# Altium project Bao Ve Qua Dong v0.1.PrjPcb
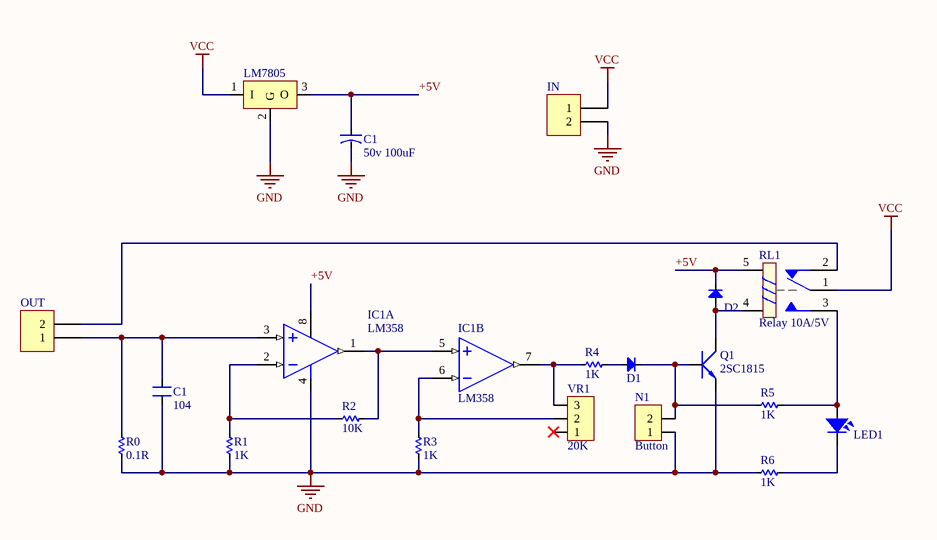
[diagram p0: Nguyen Ly.SchDoc]
1 sheet, 20 parts. Net scope: global (net labels, ports and power ports of the same name join across sheets).
Board file: PCB1.PcbDoc

## Sheet Nguyen Ly.SchDoc
size A

### Parts
(Parts that share a designator on the sheet are numbered #1, #2 ... from top to bottom, then left to right.)
C1#1  50v 100uF  [CA-ALU-5L]
C1#2  104  [CN1.5]
D1  Diode  [DIO-1A]  (value not drawn)
D2  Diode  [DIO-1A]  (value not drawn)
IC1  LM358  [DIP8]  (parts A,B of 2)
IN  (no value)  [KF2-5.08]
LED1  LED  [LED-5-BLUE]  (value not drawn)
LM7805  LM78xx  [TO220-123]  (value not drawn)
N1  Button  [Header2]
OUT  (no value)  [KF2-5.08]
Q1  2SC1815  [TO92-123]
R0  0.1R  [RES-2W]
R1  1K  [RES-1/4W]
R2  10K  [RES-1/4W]
R3  1K  [RES-1/4W]
R4  1K  [RES-1/4W]
R5  1K  [RES-1/4W]
R6  1K  [RES-1/4W]
RL1  Relay 10A/5V  [RELAY 5]
VR1  20K  [Header3]

### Nets
GND: C1#1.2 C1#2.1 IC1.4(-V) IN.2 LM7805.2(G) N1.1 Q1.1(E) R0.2 R1.2 R3.2 R6.2
VCC: IN.1 LM7805.1(I) RL1.1
+5V: C1#1.1 D2.2(K) IC1.8(+V) LM7805.3(O) RL1.5
NetC1#2_2: C1#2.2 IC1.3(IN+) OUT.1 R0.1
NetD1_1: D1.1(A) R4.2
NetD1_2: D1.2(K) N1.2 Q1.3(B) R5.2
NetD2_1: D2.1(A) Q1.2(C) RL1.4
NetIC1_1: IC1.1(OUT) IC1.5(IN+) R2.2
NetIC1_2: IC1.2(IN-) R1.1 R2.1
NetIC1_6: IC1.6(IN-) R3.1 VR1.2
NetIC1_7: IC1.7(OUT) R4.1 VR1.3
NetLED1_1: LED1.1 R5.1 RL1.3
NetLED1_2: LED1.2 R6.1
NetOUT_2: OUT.2 RL1.2

Not connected (* = marked no-connect by the designer): VR1 1*

### Library data of the parts
C1#1 = CN-ALU-DIP: Capacitor (Semiconductor SIM Model); Value: 104; LatestRevisionDate: 17-Jul-2002; LatestRevisionNote: Re-released for DXP Platform.; PackageReference: C1206; Publisher: Altium Limited
C1#2 = CN: Value: 33pF
D1 D2 = Diode: Default Diode; Code - JEDEC: DO-214-AB; Value: 1N5007; Published: 8-Jun-2000; Revision: July-2002: Re-released for DXP Platform.; Publisher: Altium Limited
IC1 = LM358: Low-Power Dual Operational Amplifier; Value: LM358
IN OUT = KF2: Manufacturer: Würth Elektronik eiSos GmbH; partNo: 691103110002; ComponentLink1 Description: Manufacturer; ComponentLink2 Description: Datasheet; NoPins: 2; Created Date: 29 October 2013; ComponentLink1URL: http://www.we-online.com; ComponentLink2URL: http://katalog.we-online.de/em/datasheet/6911031100xx.pdf; Created by: Karrer Zheng
LED1 = LED: LED Single colour Green and Red; Value: LED 3 ly Single Colour
LM7805 = LM78xx: Positive Voltage Regulator; Note: Tab is connected to pin 3 (GND).; Published: 24-Aug-2001; LatestRevisionDate: 17-Jul-2002; LatestRevisionNote: Re-released for DXP Platform.; DatasheetVersion: Apr-1994; PackageVersion: Jul-1998; PackageReference: ISOWATT220AB; Publisher: Altium Limited; PackageDescription: TO, Thru-Hole, Vertical, Heatsink Mounted; 3 In-Line Leads; Pitch 2.54 mm; Pin sequence 1, 3, 2; ComponentLink1Description: Manufacturer Link; ComponentLink1URL: http://www.st.com/; ComponentLink2Description: Datasheet; ComponentLink2URL: http://www.st.com/stonline/products/literature/ds/2146/l78m05c.pdf
N1 = Header2: Header IDC, 2 x 1 Pin Vertical 2.54mm Pitch (Non-Boxed, Male); Manufacturer: W¨¹rth Elektronik eiSos GmbH; partNo: 613002143121; ComponentLink1 Description: Manufacturer; ComponentLink2 Description: Datasheet; NoPins: 02; Created Date: 29 March 2013; ComponentLink1URL: http://www.we-online.com; ComponentLink2URL: http://katalog.we-online.de/em/datasheet/6130xx143121.pdf; Created by: Karrer Zheng
Q1 = 2SC1815: NPN 600mW, ECB; Value: C1815
R0-R6 = Res: Manufacturer: Generic Components; Class: Passive; SubClass: R; Published: 08/06/2000; Publisher: Altium Hobart Technology Centre
RL1 = Relay 5: Relay SPDT,10A - 12VDC 5 Pin; Value: Relay SPDT, 10A, 12V
VR1 = Header3: Header IDC, 3 x 1 Pin Vertical 2.54mm Pitch (Non-Boxed, Male); Manufacturer: W¨¹rth Elektronik eiSos GmbH; partNo: 613002143121; ComponentLink1 Description: Manufacturer; ComponentLink2 Description: Datasheet; NoPins: 02; Created Date: 29 March 2013; ComponentLink1URL: http://www.we-online.com; ComponentLink2URL: http://katalog.we-online.de/em/datasheet/6130xx143121.pdf; Created by: Karrer Zheng